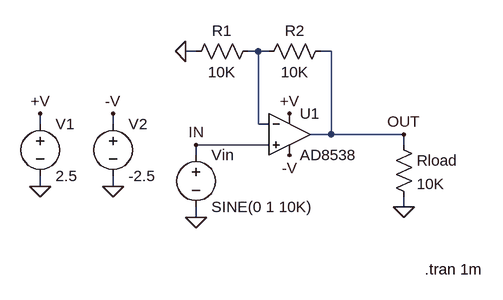
[diagram p0: schematic AD8538.asc]
AD8538.asc, the LTspice schematic file:
Version 4
SHEET 1 1240 700
WIRE 384 -1104 368 -1104
WIRE 480 -1104 464 -1104
WIRE 496 -1104 480 -1104
WIRE 592 -1104 576 -1104
WIRE 144 -992 144 -1008
WIRE 256 -992 256 -1008
WIRE 480 -992 480 -1104
WIRE 496 -992 480 -992
WIRE 592 -976 592 -1104
WIRE 592 -976 560 -976
WIRE 704 -976 592 -976
WIRE 496 -960 384 -960
WIRE 704 -960 704 -976
WIRE 384 -944 384 -960
WIRE 144 -896 144 -912
WIRE 256 -896 256 -912
WIRE 704 -864 704 -880
WIRE 384 -848 384 -864
FLAG 144 -1008 +V
FLAG 144 -896 0
FLAG 384 -848 0
FLAG 704 -976 OUT
FLAG 384 -960 IN
FLAG 528 -1008 +V
FLAG 256 -1008 -V
FLAG 528 -944 -V
FLAG 368 -1104 0
FLAG 704 -864 0
FLAG 256 -896 0
SYMBOL Opamps\\AD8538 528 -1040 R0
SYMATTR InstName U1
SYMBOL voltage 144 -1008 R0
WINDOW 123 0 0 Left 2
WINDOW 39 0 0 Left 2
SYMATTR InstName V1
SYMATTR Value 2.5
SYMBOL voltage 384 -960 R0
WINDOW 123 24 146 Left 2
WINDOW 39 24 125 Left 2
SYMATTR InstName Vin
SYMATTR Value SINE(0 1 10K)
SYMBOL res 480 -1120 R90
WINDOW 0 0 56 VBottom 2
WINDOW 3 32 56 VTop 2
SYMATTR InstName R1
SYMATTR Value 10K
SYMBOL res 592 -1120 R90
WINDOW 0 0 56 VBottom 2
WINDOW 3 32 56 VTop 2
SYMATTR InstName R2
SYMATTR Value 10K
SYMBOL voltage 256 -1008 R0
WINDOW 123 24 146 Left 2
WINDOW 39 24 125 Left 2
SYMATTR InstName V2
SYMATTR Value -2.5
SYMBOL res 688 -976 R0
SYMATTR InstName Rload
SYMATTR Value 10K
TEXT 736 -768 Left 2 !.tran 1m

The netlist it stands for:
* AD8538.asc
XU1 IN N001 +V -V OUT AD8538  ; pins In+ In- V+ V- OUT
V1 +V 0 2.5
Vin IN 0 SINE(0 1 10K)
R1 N001 0 10K
R2 OUT N001 10K
V2 -V 0 -2.5
Rload OUT 0 10K
.tran 1m
.backanno
.end